# Altium schematic sheet aafilter.SCHDOC
size B
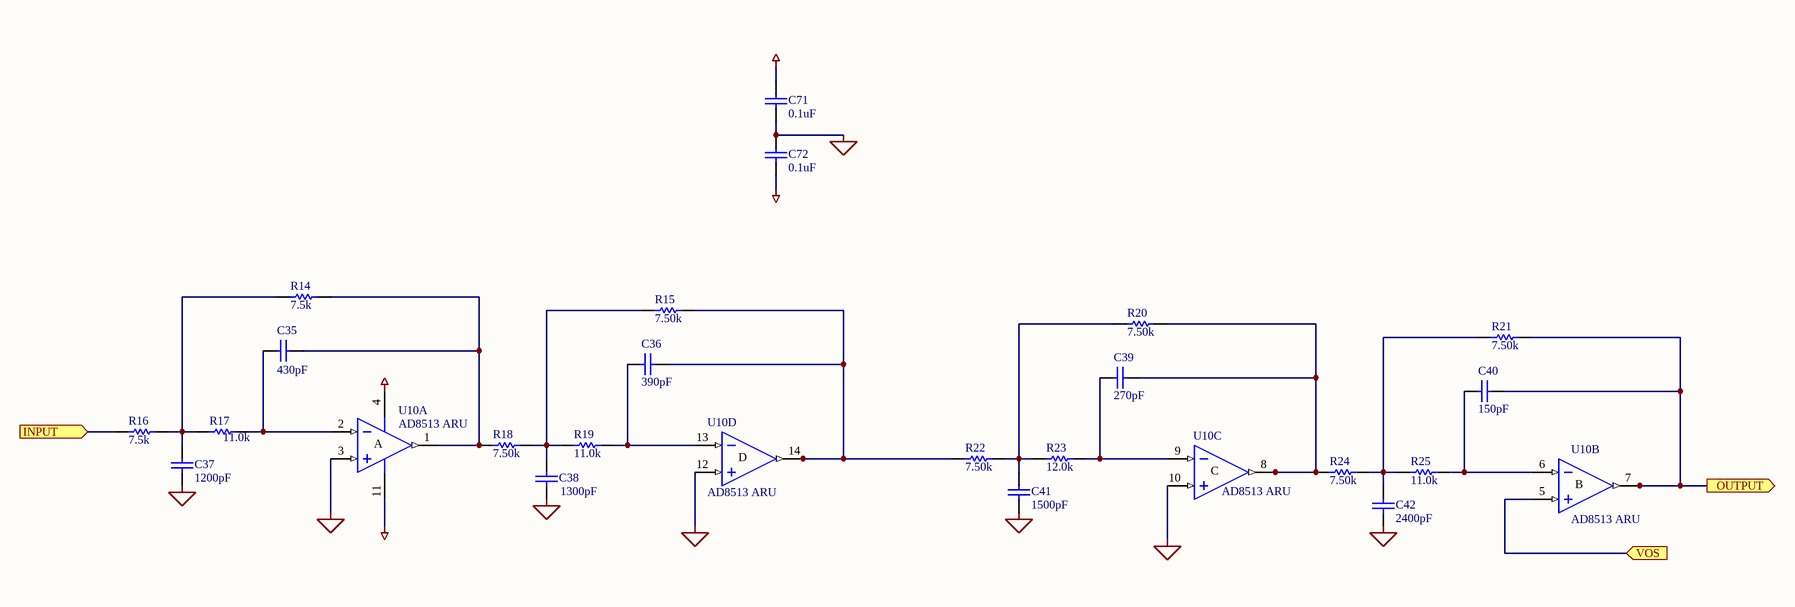
[diagram p0: aafilter.SCHDOC]

## Parts
C35  value 430pF  [CC1608-0603]  (hidden comment: Cap)
C36  value 390pF  [CC1608-0603]  (hidden comment: Cap)
C37  value 1200pF  [CC1608-0603]  (hidden comment: Cap)
C38  value 1300pF  [CC1608-0603]  (hidden comment: Cap)
C39  value 270pF  [CC1608-0603]  (hidden comment: Cap)
C40  value 150pF  [CC1608-0603]  (hidden comment: Cap)
C41  value 1500pF  [CC1608-0603]  (hidden comment: Cap)
C42  value 2400pF  [CC1608-0603]  (hidden comment: Cap)
C71  value 0.1uF  [CC1608-0603]  (hidden comment: Cap)
C72  value 0.1uF  [CC1608-0603]  (hidden comment: Cap)
R14  value 7.5k  [CC1608-0603]  (hidden comment: Res1)
R15  value 7.50k  [CC1608-0603]  (hidden comment: Res1)
R16  value 7.5k  [CC1608-0603]  (hidden comment: Res1)
R17  value 11.0k  [CC1608-0603]  (hidden comment: Res1)
R18  value 7.50k  [CC1608-0603]  (hidden comment: Res1)
R19  value 11.0k  [CC1608-0603]  (hidden comment: Res1)
R20  value 7.50k  [CC1608-0603]  (hidden comment: Res1)
R21  value 7.50k  [CC1608-0603]  (hidden comment: Res1)
R22  value 7.50k  [CC1608-0603]  (hidden comment: Res1)
R23  value 12.0k  [CC1608-0603]  (hidden comment: Res1)
R24  value 7.50k  [CC1608-0603]  (hidden comment: Res1)
R25  value 11.0k  [CC1608-0603]  (hidden comment: Res1)
U10  AD8513 ARU  [SO-G14]  (parts A,B,C,D of 4)

## Ports
INPUT (in), OUTPUT (out), VOS (in)

## Nets
AGND: C37.1 C38.1 C41.1 C42.1 C71.1 C72.2 U10.3(IN+A) U10.10(IN+C) U10.12(IN+D)
AVDD: C71.2 U10.4(V+)
AVSS: C72.1 U10.11(V-)
INPUT: R16.1 ; port INPUT
OUTPUT: C40.1 R21.1 U10.7(OUTB) ; port OUTPUT
VOS: U10.5(IN+B) ; port VOS
NetC35_1: C35.1 R14.1 R18.1 U10.1(OUTA)
NetC35_2: C35.2 R17.2 U10.2(IN-A)
NetC36_1: C36.1 R15.1 R22.1 U10.14(OUTD)
NetC36_2: C36.2 R19.2 U10.13(IN-D)
NetC37_2: C37.2 R14.2 R16.2 R17.1
NetC38_2: C38.2 R15.2 R18.2 R19.1
NetC39_1: C39.1 R20.1 R24.1 U10.8(OUTC)
NetC39_2: C39.2 R23.2 U10.9(IN-C)
NetC40_2: C40.2 R25.2 U10.6(IN-B)
NetC41_2: C41.2 R20.2 R22.2 R23.1
NetC42_2: C42.2 R21.2 R24.2 R25.1

## Notes on the sheet
- (in symbol AD8513ARU, part A) A
- (in symbol AD8513ARU, part B) B
- (in symbol AD8513ARU, part C) C
- (in symbol AD8513ARU, part D) D

## Library data of the parts
C35-C42 C71 C72 = Cap: Capacitor; Manufacturer: Generic Components; Class I: Passive; Published: 8-Jun-2000; Revision: July-2002: Re-released for DXP Platform.; Publisher: Altium Limited; Class II: Capacitor
R14-R25 = Res1: Resistor; Manufacturer: Generic Components; Class I: Passive; Published: 8-Jun-2000; Revision: July-2002: Re-released for DXP Platform.; Publisher: Altium Limited; Class II: Resistor
U10 = AD8513ARU: low-noise JFET quad OA; Vendor: Analog Devices